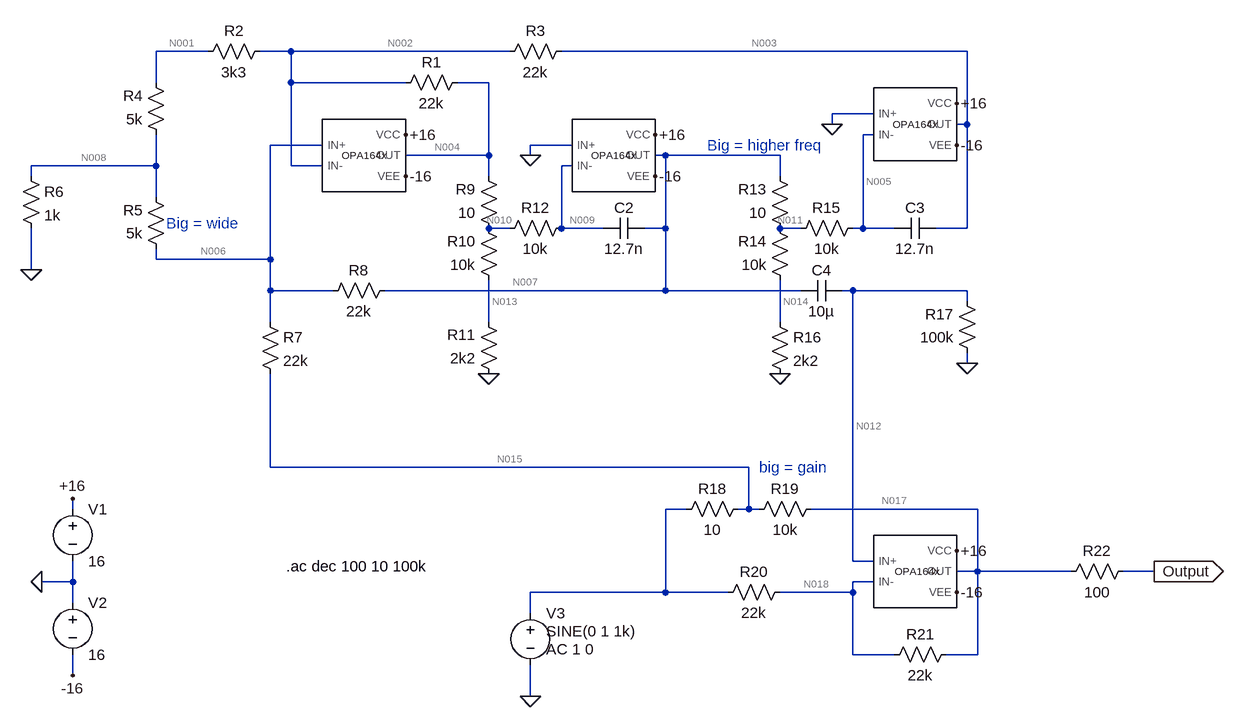
[diagram p0: schematic BandA.asc]
BandA.asc, the LTspice schematic file:
Version 4.1
SHEET 1 1196 1060
WIRE -400 16 -480 16
WIRE -272 16 -320 16
WIRE 64 16 -272 16
WIRE 768 16 144 16
WIRE -480 64 -480 16
WIRE -272 64 -272 16
WIRE -96 64 -272 64
WIRE 32 64 -16 64
WIRE 624 112 560 112
WIRE 560 128 560 112
WIRE 768 128 768 16
WIRE 768 128 752 128
WIRE 624 144 608 144
WIRE -224 160 -304 160
WIRE 160 160 96 160
WIRE 32 176 32 64
WIRE 32 176 -96 176
WIRE 96 176 96 160
WIRE 304 176 288 176
WIRE 480 176 304 176
WIRE -480 192 -480 144
WIRE -480 192 -672 192
WIRE -272 192 -272 64
WIRE -224 192 -272 192
WIRE 160 192 144 192
WIRE -672 208 -672 192
WIRE 32 208 32 176
WIRE 480 208 480 176
WIRE -480 240 -480 192
WIRE 64 288 32 288
WIRE 144 288 144 192
WIRE 208 288 144 288
WIRE 304 288 304 176
WIRE 304 288 272 288
WIRE 512 288 480 288
WIRE 608 288 608 144
WIRE 608 288 592 288
WIRE 656 288 608 288
WIRE 768 288 768 128
WIRE 768 288 720 288
WIRE -480 336 -480 320
WIRE -304 336 -304 160
WIRE -304 336 -480 336
WIRE -672 352 -672 288
WIRE -304 384 -304 336
WIRE -208 384 -304 384
WIRE 304 384 304 288
WIRE 304 384 -128 384
WIRE 512 384 304 384
WIRE 592 384 576 384
WIRE 768 384 592 384
WIRE 768 400 768 384
WIRE -304 432 -304 384
WIRE 32 432 32 368
WIRE 480 432 480 368
WIRE 768 496 768 480
WIRE -304 656 -304 512
WIRE 432 656 -304 656
WIRE -608 720 -608 704
WIRE 336 720 304 720
WIRE 432 720 432 656
WIRE 432 720 416 720
WIRE 448 720 432 720
WIRE 784 720 528 720
WIRE 592 800 592 384
WIRE 624 800 592 800
WIRE 784 816 784 720
WIRE 784 816 752 816
WIRE 928 816 784 816
WIRE 1056 816 1008 816
WIRE -608 832 -608 800
WIRE -608 832 -656 832
WIRE 624 832 592 832
WIRE 304 848 304 720
WIRE 304 848 96 848
WIRE 400 848 304 848
WIRE 592 848 592 832
WIRE 592 848 480 848
WIRE -608 864 -608 832
WIRE 96 880 96 848
WIRE 592 944 592 848
WIRE 656 944 592 944
WIRE 784 944 784 816
WIRE 784 944 736 944
WIRE -608 976 -608 944
WIRE 96 1008 96 960
FLAG -672 352 0
FLAG 96 176 0
FLAG 32 512 0
FLAG 480 512 0
FLAG 768 496 0
FLAG 1056 816 Output
IOPIN 1056 816 Out
FLAG 560 128 0
FLAG -656 832 0
FLAG -608 704 +16
FLAG -96 144 +16
FLAG 288 144 +16
FLAG 752 96 +16
FLAG 752 784 +16
FLAG -608 976 -16
FLAG -96 208 -16
FLAG 288 208 -16
FLAG 752 160 -16
FLAG 752 848 -16
FLAG 96 1008 0
SYMBOL BandA\\OPA164x -160 176 R0
WINDOW 0 0 0 Invisible 0
WINDOW 3 0 0 Center 1
SYMATTR InstName U1
SYMATTR ModelFile C:\Users\ebul0\Downloads\sbom627d\OPA164x.LIB
SYMBOL BandA\\OPA164x 224 176 R0
WINDOW 0 0 0 Invisible 0
WINDOW 3 0 0 Center 1
SYMATTR InstName U2
SYMATTR ModelFile C:\Users\ebul0\Downloads\sbom627d\OPA164x.LIB
SYMBOL BandA\\OPA164x 688 128 R0
WINDOW 0 0 0 Invisible 0
WINDOW 3 0 0 Center 1
SYMATTR InstName U3
SYMATTR ModelFile C:\Users\ebul0\Downloads\sbom627d\OPA164x.LIB
SYMBOL BandA\\OPA164x 688 816 R0
WINDOW 3 3 0 Center 1
WINDOW 0 0 0 Invisible 0
SYMATTR InstName U4
SYMATTR ModelFile C:\Users\ebul0\Downloads\sbom627d\OPA164x.LIB
SYMBOL res 0 48 R90
WINDOW 0 0 56 VBottom 2
WINDOW 3 32 56 VTop 2
SYMATTR InstName R1
SYMATTR Value 22k
SYMBOL res -304 0 R90
WINDOW 0 0 56 VBottom 2
WINDOW 3 32 56 VTop 2
SYMATTR InstName R2
SYMATTR Value 3k3
SYMBOL res 160 0 R90
WINDOW 0 0 56 VBottom 2
WINDOW 3 32 56 VTop 2
SYMATTR InstName R3
SYMATTR Value 22k
SYMBOL res -464 160 R180
WINDOW 0 36 76 Left 2
WINDOW 3 36 40 Left 2
SYMATTR InstName R4
SYMATTR Value 5k
SYMBOL res -464 336 R180
WINDOW 0 36 76 Left 2
WINDOW 3 36 40 Left 2
SYMATTR InstName R5
SYMATTR Value 5k
SYMBOL res -688 192 R0
SYMATTR InstName R6
SYMATTR Value 1k
SYMBOL res -320 416 R0
SYMATTR InstName R7
SYMATTR Value 22k
SYMBOL res -112 368 R90
WINDOW 0 0 56 VBottom 2
WINDOW 3 32 56 VTop 2
SYMATTR InstName R8
SYMATTR Value 22k
SYMBOL res 48 304 R180
WINDOW 0 36 76 Left 2
WINDOW 3 36 40 Left 2
SYMATTR InstName R9
SYMATTR Value 10
SYMBOL res 48 384 R180
WINDOW 0 36 76 Left 2
WINDOW 3 36 40 Left 2
SYMATTR InstName R10
SYMATTR Value 10k
SYMBOL res 48 528 R180
WINDOW 0 36 76 Left 2
WINDOW 3 36 40 Left 2
SYMATTR InstName R11
SYMATTR Value 2k2
SYMBOL cap 272 272 R90
WINDOW 0 0 32 VBottom 2
WINDOW 3 32 32 VTop 2
SYMATTR InstName C2
SYMATTR Value 12.7n
SYMBOL res 160 272 R90
WINDOW 0 0 56 VBottom 2
WINDOW 3 32 56 VTop 2
SYMATTR InstName R12
SYMATTR Value 10k
SYMBOL res 496 304 R180
WINDOW 0 36 76 Left 2
WINDOW 3 36 40 Left 2
SYMATTR InstName R13
SYMATTR Value 10
SYMBOL res 496 384 R180
WINDOW 0 36 76 Left 2
WINDOW 3 36 40 Left 2
SYMATTR InstName R14
SYMATTR Value 10k
SYMBOL res 608 272 R90
WINDOW 0 0 56 VBottom 2
WINDOW 3 32 56 VTop 2
SYMATTR InstName R15
SYMATTR Value 10k
SYMBOL cap 720 272 R90
WINDOW 0 0 32 VBottom 2
WINDOW 3 32 32 VTop 2
SYMATTR InstName C3
SYMATTR Value 12.7n
SYMBOL cap 576 368 R90
WINDOW 0 0 32 VBottom 2
WINDOW 3 32 32 VTop 2
SYMATTR InstName C4
SYMATTR Value 10µ
SYMBOL res 464 416 R0
SYMATTR InstName R16
SYMATTR Value 2k2
SYMBOL res 784 496 R180
WINDOW 0 36 76 Left 2
WINDOW 3 36 40 Left 2
SYMATTR InstName R17
SYMATTR Value 100k
SYMBOL res 432 704 R90
WINDOW 0 0 56 VBottom 2
WINDOW 3 32 56 VTop 2
SYMATTR InstName R18
SYMATTR Value 10
SYMBOL res 544 704 R90
WINDOW 0 0 56 VBottom 2
WINDOW 3 32 56 VTop 2
SYMATTR InstName R19
SYMATTR Value 10k
SYMBOL res 496 832 R90
WINDOW 0 0 56 VBottom 2
WINDOW 3 32 56 VTop 2
SYMATTR InstName R20
SYMATTR Value 22k
SYMBOL res 752 928 R90
WINDOW 0 0 56 VBottom 2
WINDOW 3 32 56 VTop 2
SYMATTR InstName R21
SYMATTR Value 22k
SYMBOL res 1024 800 R90
WINDOW 0 0 56 VBottom 2
WINDOW 3 32 56 VTop 2
SYMATTR InstName R22
SYMATTR Value 100
SYMBOL voltage -608 704 R0
WINDOW 123 0 0 Left 0
WINDOW 39 0 0 Left 0
SYMATTR InstName V1
SYMATTR Value 16
SYMBOL voltage -608 848 R0
WINDOW 123 0 0 Left 0
WINDOW 39 0 0 Left 0
SYMATTR InstName V2
SYMATTR Value 16
SYMBOL voltage 96 864 R0
WINDOW 3 24 44 Left 2
WINDOW 123 24 72 Left 2
WINDOW 39 0 0 Left 0
SYMATTR Value SINE(0 1 1k)
SYMATTR Value2 AC 1 0
SYMATTR InstName V3
TEXT -280 808 Left 2 !.ac dec 100 10 100k
TEXT -464 280 Left 2 ;Big = wide
TEXT 368 160 Left 2 ;Big = higher freq
TEXT 448 656 Left 2 ;big = gain

The netlist it stands for:
* BandA.asc
X§U1 N006 N002 +16 -16 N004 OPA164x  ; pins IN+ IN- VCC VEE OUT
X§U2 0 N009 +16 -16 N007 OPA164x  ; pins IN+ IN- VCC VEE OUT
X§U3 0 N005 +16 -16 N003 OPA164x  ; pins IN+ IN- VCC VEE OUT
X§U4 N012 N018 +16 -16 N017 OPA164x  ; pins IN+ IN- VCC VEE OUT
R1 N004 N002 22k
R2 N002 N001 3k3
R3 N003 N002 22k
R4 N008 N001 5k
R5 N006 N008 5k
R6 N008 0 1k
R7 N006 N015 22k
R8 N007 N006 22k
R9 N010 N004 10
R10 N013 N010 10k
R11 0 N013 2k2
C2 N007 N009 12.7n
R12 N009 N010 10k
R13 N011 N007 10
R14 N014 N011 10k
R15 N005 N011 10k
C3 N003 N005 12.7n
C4 N012 N007 10µ
R16 N014 0 2k2
R17 0 N012 100k
R18 N015 N016 10
R19 N017 N015 10k
R20 N018 N016 22k
R21 N017 N018 22k
R22 Output N017 100
V1 +16 0 16
V2 0 -16 16
V3 N016 0 SINE(0 1 1k) AC 1 0
.ac dec 100 10 100k
* Big = wide
* Big = higher freq
* big = gain
.lib C:\Users\ebul0\Downloads\sbom627d\OPA164x.LIB
.backanno
.end

* Results of the author's LTspice run, read from the files saved beside the schematic
* Operating Point, zero values left out:
*   V(+16) = 16 V
*   V(-16) = -16 V
*   V(n001) = 822.7 µV
*   V(n002) = 1.263 mV
*   V(n003) = 4.463 mV
*   V(n004) = 1.001 mV
*   V(n005) = 999.9 µV
*   V(n006) = 263.4 µV
*   V(n007) = 1.001 mV
*   V(n008) = 155.2 µV
*   V(n009) = 999.9 µV
*   V(n010) = 999.9 µV
*   V(n011) = 999.9 µV
*   V(n012) = -200 nV
*   V(n013) = 180.3 µV
*   V(n014) = 180.3 µV
*   V(n015) = 2.116 µV
*   V(n017) = 1.999 mV
*   V(n018) = 999.7 µV
*   V(output) = 1.999 mV
*   I(R1) = -11.93 nA
*   I(R10) = -81.96 nA
*   I(R11) = -81.96 nA
*   I(R13) = -81.96 nA
*   I(R14) = -81.96 nA
*   I(R16) = 81.96 nA
*   I(R17) = 2 pA
*   I(R18) = 211.6 nA
*   I(R19) = 199.7 nA
*   I(R2) = 133.5 nA
*   I(R20) = 45.44 nA
*   I(R21) = 45.44 nA
*   I(R3) = 145.4 nA
*   I(R4) = -133.5 nA
*   I(R5) = 21.64 nA
*   I(R6) = 155.2 nA
*   I(R7) = 11.87 nA
*   I(R8) = 33.52 nA
*   I(R9) = -81.96 nA
*   I(V1) = -7.201 mA
*   I(V2) = -7.2 mA
*   I(V3) = 257.1 nA
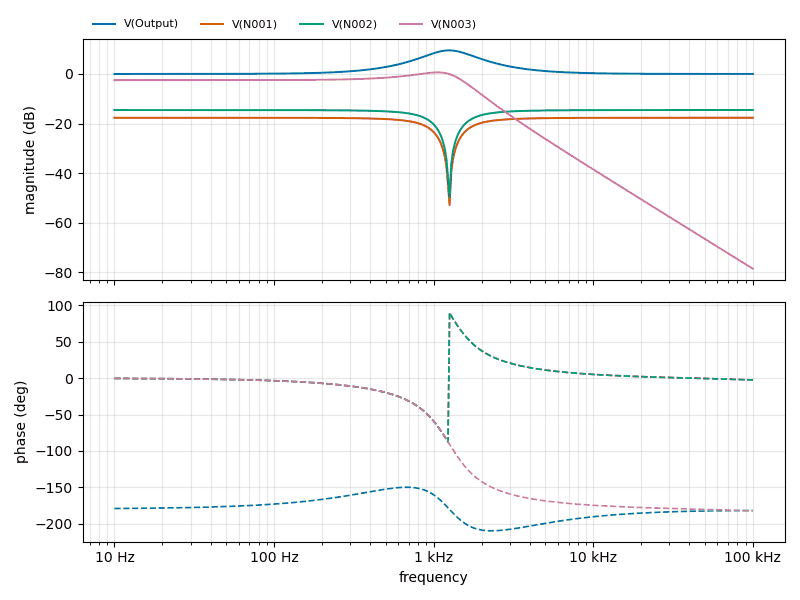
[diagram p1: AC Analysis of BandA.asc, plotted from the saved traces]
* AC Analysis, 1 run:
*   V(Output): -0.00 dB at 10 Hz, 0.02 dB at 100 kHz, peak 9.52 dB at 1.259 kHz, 3 dB below the peak at 826.1 Hz and 1.895 kHz
*   V(N001): -17.67 dB at 10 Hz, -17.66 dB at 100 kHz, peak -17.66 dB at 100 kHz, 3 dB below the peak at 1.808 kHz
*   V(N002): -14.56 dB at 10 Hz, -14.55 dB at 100 kHz, peak -14.55 dB at 100 kHz, 3 dB below the peak at 1.809 kHz
*   V(N003): -2.50 dB at 10 Hz, -78.58 dB at 100 kHz, peak 0.63 dB at 1.047 kHz, 3 dB below the peak at 173.7 Hz and 1.488 kHz